# EAGLE design leoTracker (EAGLE 6.5.0)
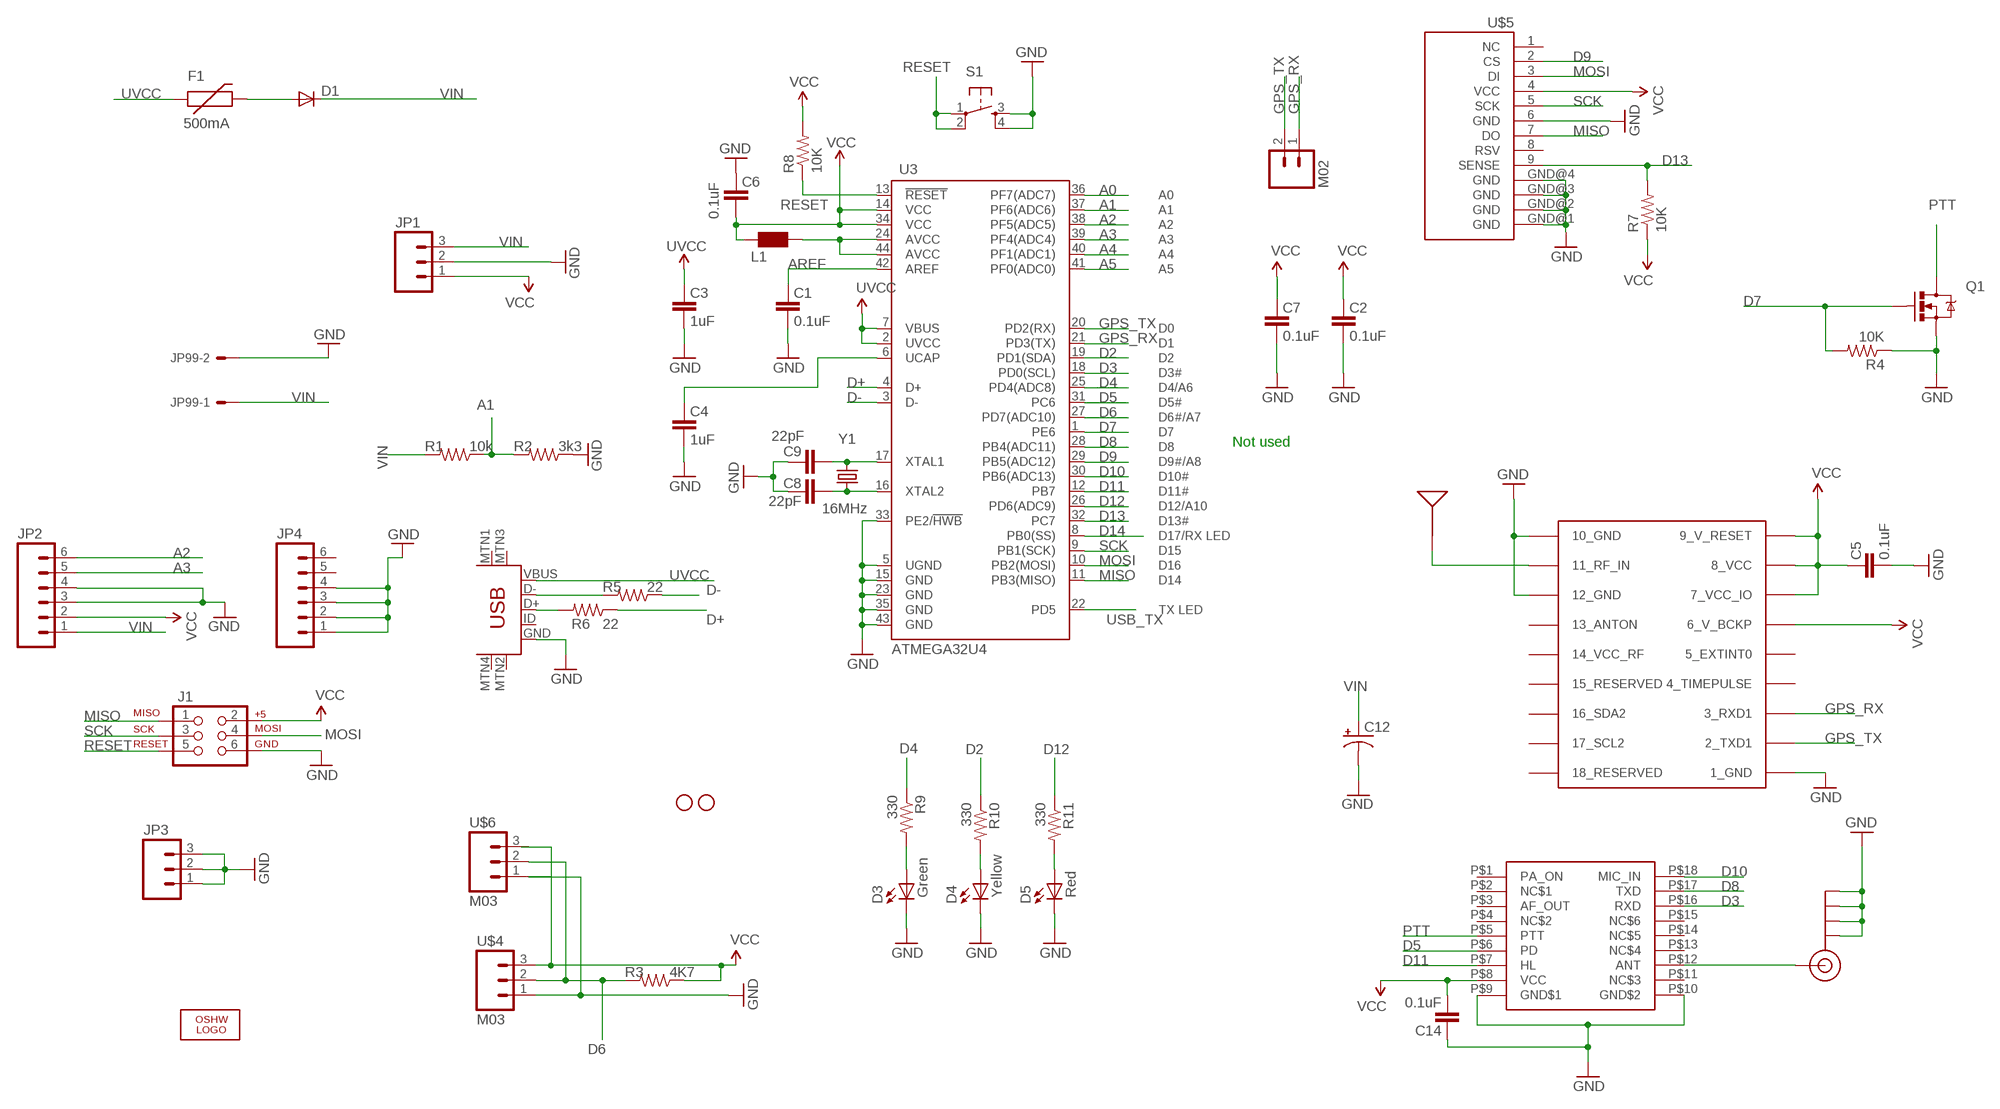
[diagram p0: schematic, sheet 1]

## Parts
C1  0.1uF  CAP0805  [0805]
C2  0.1uF  CAP0402-CAP  [0402-CAP]
C3  1uF  CAP0805  [0805]
C4  1uF  CAP0805  [0805]
C5  0.1uF  CAP0805  [0805]
C6  0.1uF  CAP0805  [0805]
C7  0.1uF  CAP0402-CAP  [0402-CAP]
C8  22pF  CAP0805  [0805]
C9  22pF  CAP0805  [0805]
C12  CPOL-US153CLV-0405  [153CLV-0405]
C14  0.1uF  CAP0805  [0805]
D1  DIODESOD  [SOD-323]
D3  Green  LED0603  [LED-0603]
D4  Yellow  LED0603  [LED-0603]
D5  Red  LED0603  [LED-0603]
F1  500mA  PTCSMD  [PTC-1206]
J1  AVR_SPI_PRG_6PTH  [2X3]
J$1  SMA_EDGE  [SMA-EDGE]
JP1  M03LOCK  [1X03_LOCK]
JP2  M06LOCK  [1X06_LOCK]
JP3  M03LOCK  [1X03_LOCK]
JP4  M06LOCK  [1X06_LOCK]
JP99  22-27-2021-02  [6410-02]
L1  MH2029-300Y  WE-CBF_0805  [0805]
LOGO1  OSHW_LOGO_8MILX0200-NT  [OSHW_8X200_NOTEXT]
Q1  MOSFET-NCHANNELSMD  [SOT23-3]
R1  10k  RESISTOR0805-RES  [0805]
R2  3k3  RESISTOR0805-RES  [0805]
R3  4K7  RESISTOR0805-RES  [0805]
R4  10K  RESISTOR0805-RES  [0805]
R5  22  RESISTOR0805-RES  [0805]
R6  22  RESISTOR0805-RES  [0805]
R7  10K  RESISTOR0805-RES  [0805]
R8  10K  RESISTOR0805-RES  [0805]
R9  330  RESISTOR0805-RES  [0805]
R10  330  RESISTOR0805-RES  [0805]
R11  330  RESISTOR0805-RES  [0805]
S1  TAC_SWITCHSMD  [TACTILE_SWITCH_SMD]
STANDOFF1  STAND-OFFTIGHT  [STAND-OFF-TIGHT]
STANDOFF2  STAND-OFFTIGHT  [STAND-OFF-TIGHT]
U3  ATMEGA32U4  ATMEGA32U4TQFP  [SPARKFUN-DIGITALIC_TQFP44]
U$1  ANTENNA2SMD6  [ANTENNA-CHIP6]
U$2  UBLOX_MAX  [UBLOX_MAX]
U$4  M03  [M03-JST]
U$5  MICROSD_PI  [MICROSD_PP]
U$6  M03  [M03-JST]
U$7  SA818  [SA818]
U$8  M02  [M02]
X1  USB-MINIB-5PIN  [USB-MINIB]
Y1  16MHz  ABRACON_ABM3_CRYSTAL  [ABRACON_ABM3_CRYSTAL]

## Nets
A0: U3.36(PF7(ADC7))
A1: R1.1 R2.2 U3.37(PF6(ADC6))
A2: JP2.6 U3.38(PF5(ADC5))
A3: JP2.5 U3.39(PF4(ADC4))
A4: U3.40(PF1(ADC1))
A5: U3.41(PF0(ADC0))
AREF: C1.2 U3.42(AREF)
D2: R10.1 U3.19(PD1(SDA))
D3: U3.18(PD0(SCL)) U$7.P$16(RXD)
D4: R9.1 U3.25(PD4(ADC8))
D5: U3.31(PC6) U$7.P$6(PD)
D6: R3.2 U3.27(PD7(ADC10)) U$4.2 U$6.2
D7: Q1.1(G) R4.2 U3.1(PE6)
D8: U3.28(PB4(ADC11)) U$7.P$17(TXD)
D9: U3.29(PB5(ADC12)) U$5.2(CS)
D10: U3.30(PB6(ADC13)) U$7.P$18(MIC_IN)
D11: U3.12(PB7) U$7.P$7(HL)
D12: R11.1 U3.26(PD6(ADC9))
D13: R7.2 U3.32(PC7) U$5.9(SENSE)
D14: U3.8(PB0(SS))
D+: R6.1 U3.4(D+)
D-: R5.1 U3.3(D-)
GND [vcc]: C1.1 C2.1 C3.1 C4.1 C5.1 C6.2 C7.1 C8.2 C9.2 C12.- C14.2 D3.C D4.C D5.C J1.6 J$1.GND@0(GND) J$1.GND@1(GND) J$1.GND@2(GND) J$1.GND@3(GND) JP1.2 JP2.3 JP2.4 JP3.1 JP3.2 JP3.3 JP4.1 JP4.2 JP4.3 JP4.4 JP99.2 Q1.2(S) R2.1 R4.1 S1.3 S1.4 U3.5(UGND) U3.15(GND) U3.23(GND) U3.33(PE2/!HWB) U3.35(GND) U3.43(GND) U$2.1_GND U$2.10_GND U$2.12_GND U$4.1 U$5.6(GND) U$5.GND@1(GND) U$5.GND@2(GND) U$5.GND@3(GND) U$5.GND@4(GND) U$6.1 U$7.P$9(GND$1) U$7.P$10(GND$2) X1.GND
GPS_RX: U3.21(PD3(TX)) U$2.3_RXD1 U$8.1
GPS_TX: U3.20(PD2(RX)) U$2.2_TXD1 U$8.2
MISO: J1.1 U3.11(PB3(MISO)) U$5.7(DO)
MOSI: J1.4 U3.10(PB2(MOSI)) U$5.3(DI)
N$1: C8.1 U3.16(XTAL2) Y1.P$1
N$2: C9.1 U3.17(XTAL1) Y1.P$2
N$3: D1.2(A) F1.2
N$4: C4.2 U3.6(UCAP)
N$5: D3.A R9.2
N$6: R5.2 X1.D-
N$7: D4.A R10.2
N$8: R6.2 X1.D+
N$10: D5.A R11.2
N$11: U$1.1(SIGNAL) U$2.11_RF_IN
N$15: L1.2 U3.24(AVCC) U3.44(AVCC)
N$20: J$1.SIG(SIGNAL) U$7.P$12(ANT)
PTT: Q1.3(D) U$7.P$5(PTT)
RESET: J1.5 R8.1 S1.1 S1.2 U3.13(!RESET)
SCK: J1.3 U3.9(PB1(SCK)) U$5.5(SCK)
USB_TX: U3.22(PD5)
UVCC: C3.2 F1.1 U3.2(UVCC) U3.7(VBUS) X1.VBUS
VCC: C2.2 C5.2 C6.1 C7.2 C14.1 J1.2 JP1.1 JP2.2 L1.1 R3.1 R7.1 R8.2 U3.14(VCC) U3.34(VCC) U$2.6_V_BCKP U$2.7_VCC_IO U$2.8_VCC U$2.9_V_RESET U$4.3 U$5.4(VCC) U$6.3 U$7.P$8(VCC)
VIN: C12.+ D1.1(C) JP1.3 JP2.1 JP99.1 R1.2
Unconnected: JP4.5 JP4.6 U$2.4_TIMEPULSE U$2.5_EXTINT0 U$2.13_ANTON U$2.14_VCC_RF U$2.15_RESERVED U$2.16_SDA2 U$2.17_SCL2 U$2.18_RESERVED U$5.1(NC) U$5.8(RSV) U$7.P$1(PA_ON) U$7.P$2(NC$1) U$7.P$3(AF_OUT) U$7.P$4(NC$2) U$7.P$11(NC$3) U$7.P$13(NC$4) U$7.P$14(NC$5) U$7.P$15(NC$6) X1.ID X1.MTN1(MTN2) X1.MTN2(MTN3) X1.MTN3(MTN1) X1.MTN4

## Notes on the sheet
- Not used

## Library data of the parts
C1 C3-C6 C8 C9 C14 = SparkFun-Capacitors:CAP: Capacitor Standard 0603 ceramic capacitor, and 0.1" leaded capacitor.
C2 C7 = SparkFun:CAP: Capacitor Standard 0603 ceramic capacitor, and 0.1" leaded capacitor.
C12 = rcl:CPOL-US: POLARIZED CAPACITOR, American symbol
D1 = SparkFun:DIODE: Diode These are standard reverse protection diodes and small signal diodes. SMA package can handle up to about 1A. SOD-323 can handle about 200mA. What the SOD-323 package when ordering, there are some mfgs out there that are 5-pin packages.
D3-D5 = SparkFun-LED:LED: LEDs Standard schematic elements and footprints for 5mm, 3mm, 1206, and 0603 sized LEDs. 5mm - Spark Fun Electronics SKU : COM-00529 (and others)
F1 = SparkFun:PTC: Resettable Fuse PTC Resettable Fuse. Spark Fun Electronics SKU : COM-08357
J1 = SparkFun-Connectors:AVR_SPI_PRG_6: AVR ISP 6 Pin This is the reduced ISP connector for AVR programming. Common on Arduino. This footprint will take up less PCB space and can be used with a 10-pin to 6-pin adapter such as SKU: BOB-08508
J$1 = SparkFun:SMA_EDGE: SMA Antenna Connector End launch SMA connector. The paste layer has been removed so that the connector can be hand soldered onto the board after reflow.
JP1 JP3 = SparkFun:M03: Header 3 Standard 3-pin 0.1" header. Use with straight break away headers (SKU : PRT-00116), right angle break away headers (PRT-00553), swiss pins (PRT-00743), machine pins (PRT-00117), and female headers (PRT-00115). Molex polarized connector foot print use with SKU : PRT-08232 with associated crimp pins and housings.
JP2 JP4 = SparkFun:M06: Header 6 Standard 6-pin 0.1" header. Use with straight break away headers (SKU : PRT-00116), right angle break away headers (PRT-00553), swiss pins (PRT-00743), machine pins (PRT-00117), and female headers (PRT-00115). Molex polarized connector foot print use with SKU : PRT-08094 with associated crimp pins and housings. NOTES ON THE VARIANTS LOCK and LOCK_LONGPADS... This footprint was designed to help hold the alignment of a through-hole component (i.e. 6-pin header) while soldering it into place. You may notice that each hole has been shifted either up or down by 0.005 of an inch from it's more standard position (which is a perfectly straight line). This slight alteration caused the pins (the squares in the middle) to touch the edges of the holes. Because they are alternating, it causes a "brace" to hold the component in place. 0.005 has proven to be the perfect amount of "off-center" position when using our standard breakaway headers. Although looks a little odd when you look at the bare footprint, once you have a header in there, the alteration is very hard to notice. Also, if you push a header all the way into place, it is covered up entirely on the bottom side. This idea of altering the position of holes to aid alignment will be further integrated into the Sparkfun Library for other footprints. It can help hold any component with 3 or more connection pins.
JP99 = con-molex:22-?-02: CONNECTOR wire to board 2.54 mm (.1 inch) pitch header; OC_FARNELL: unknown; OC_NEWARK: unknown
L1 = wuerth-elektronik:WE-CBF: SMD EMI Suppression Ferrite Beads - excellent anti-EMI properties - low DCR - impedances till 3000 ohms - rated current up to 6 A
LOGO1 = ohw-logo:OSHW_LOGO_8MIL
Q1 = SparkFun:MOSFET-NCHANNEL
R1-R11 = SparkFun-Passives:RESISTOR: Resistor Basic schematic elements and footprints for 0603, 1206, and PTH resistors.
S1 = SparkFun:TAC_SWITCH: Momentary Switch Button commonly used for reset or general input. Spark Fun Electronics SKU : COM-00097
STANDOFF1 STANDOFF2 = SparkFun-Electromechanical:STAND-OFF: #4 Stand Off This is the mechanical footprint for a #4 phillips button head screw. Use the keepout ring to avoid running the screw head into surrounding components. SKU : PRT-00447
U3 = SparkFun-DigitalIC:ATMEGA32U4: Atmel 44-pin 8-bit Microcontroller with 32KBytes of ISP Flash and USB Controller ----- Please use the QFN-44-NOPAD_1:1 package for the footprint of all boards using a 32U4. Route traces directly away from the pads as much as possible.; PROD_ID: IC-11161
U$1 = SparkFun-RF:ANTENNA2: Chip antenna Single endded antenna. Common with smaller chip antennas. CHIP4 package is the GPS Chip Antenna SKU: GPS-08418. CHIP5 package is 2.4GHz chip antenna SKU: WRL-00144.
U$2 = Ava:UBLOX_MAX: UBLOX MAX
U$4 U$6 = Ava2:M03
U$5 = MICROSD_PITO:MICROSD_PI
U$7 = nicerf:SA818
U$8 = hackedAva:M02
X1 = SparkFun-Connectors:USB-MINIB: Mini-USB "B" connector with 5th pin broken out. Created new symbol breaking out 5th "ID" pin in mini/micro USB connector spec. See: http://en.wikipedia.org/wiki/Mini_usb#Cables. Uses same footprint as 4-pin symbol. Also added pins to connect to mounting / shield pads if required (probably not generally needed as signals aren't shielded once they leave the connector).
Y1 = newAva:ABRACON_ABM3_CRYSTAL

## Net classes
0 ten10: width 0.254 mm
1 vcc: width 0.254 mm
2 20: width 0.508 mm

## Board
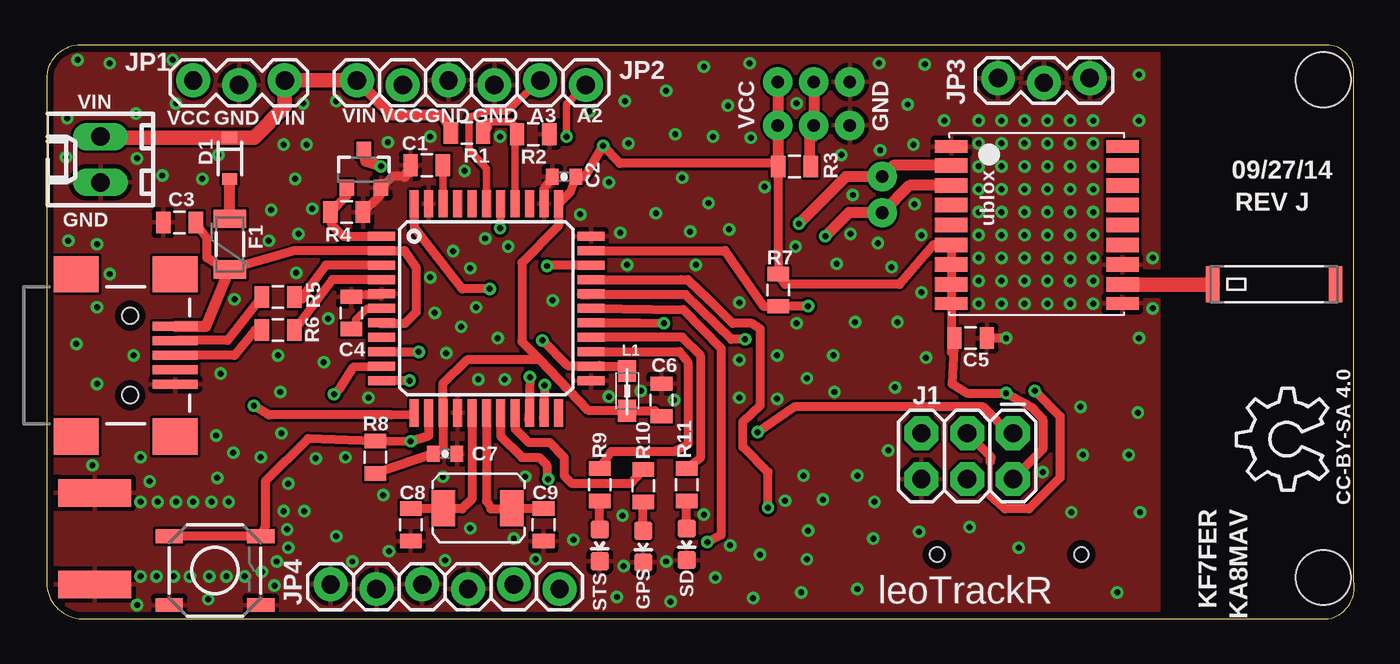
[diagram p1: board, top side]
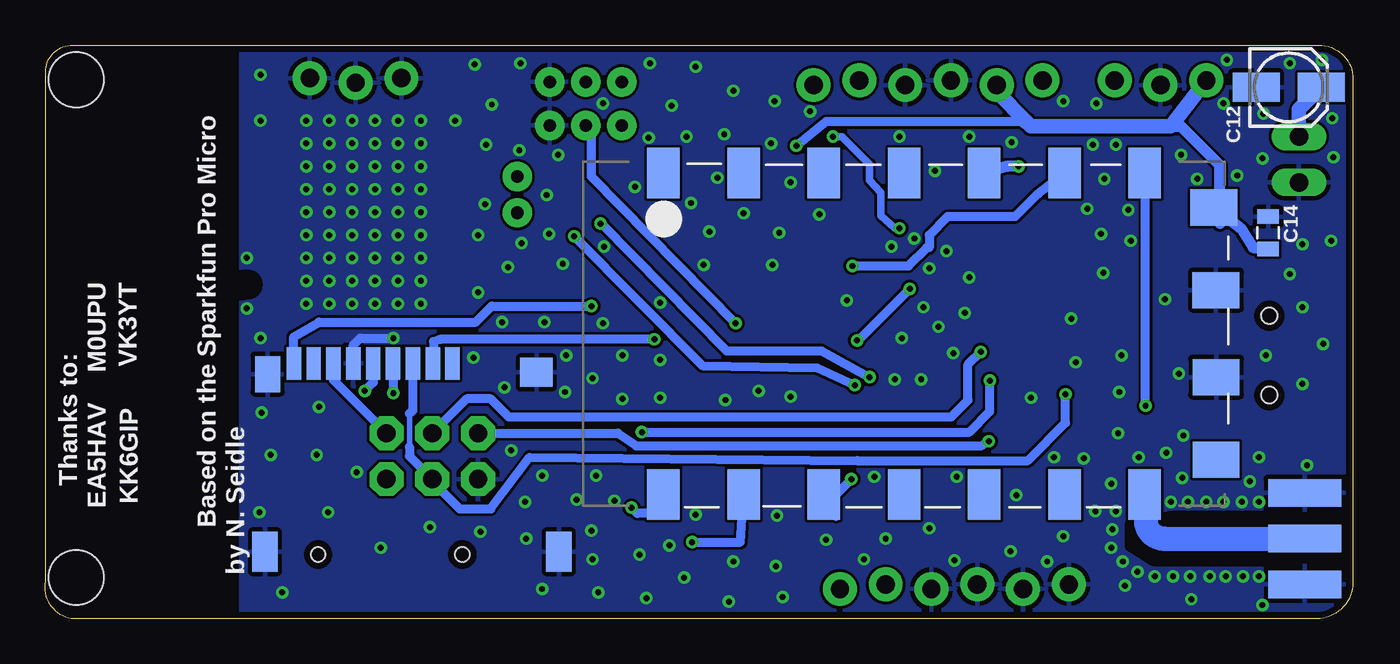
[diagram p2: board, bottom side, seen from below]

Size 72.53 x 31.81 mm. Coordinates in mm from the lower left corner, seen from the top.
Outline: 2,0 71.07,0 arc90 72.5,2.06 72.5,30.18 arc90 71.14,31.8 2.06,31.8 arc90 0,30.11 0,2 arc90 2,0
Copper layers (1*16): Top 0.0356mm / dielectric 1.5011mm / Bottom 0.0356mm
Design rules "LaenPCBOrder *": minimum track width 6mil, minimum drill 13mil, track to track 6mil, track to pad 6mil, pad to pad 6mil, via to via 6mil, smd to smd 6mil, copper to edge 15mil, drill to drill 6mil, minimum pad ring 7mil, minimum via ring 7mil, stop-mask expansion 3mil, vias tented up to drill 25mil, thermal gap 10mil
tRestrict: 2 lines
bRestrict: 7 lines

### Footprints (pad centres in the part's own frame; a part is rotated, then mirrored left to right if it is on the bottom)
0805 = smd 0.8 x 1.2: 1 -0.9,0; 2 0.9,0
0402-CAP = smd 0.7 x 0.9: 1 -0.65,0; 2 0.65,0
153CLV-0405 = smd 2.6 x 1.6: + 1.8,0; - -1.8,0
SOD-323 = smd 0.63 x 0.83: 1 -1.15,0; 2 1.15,0
LED-0603 = smd 1 x 1: A 0,-0.877; C 0,0.877
PTC-1206 = smd 1 x 1.8: 1 -1.4,0; 2 1.4,0
2X3 = drill 1.016 pad 1.88 octagon: 1 0,0; 2 0,2.54; 3 2.54,0; 4 2.54,2.54; 5 5.08,0; 6 5.08,2.54
SMA-EDGE = smd 1.524 x 4.064: GND@0 0,0; GND@1 5.08,0; SIG 2.54,0 | smd 1.524 x 4.064 bottom: GND@2 0,0; GND@3 5.08,0
1X03_LOCK = drill 1.016 pad 1.88: 1 0,0.127; 2 2.54,-0.127; 3 5.08,0.127
1X06_LOCK = drill 1.016 pad 1.88: 1 0,0; 2 2.54,-0.254; 3 5.08,0; 4 7.62,-0.254; 5 10.16,0; 6 12.7,-0.254
6410-02 = drill 1.016 long: 1 1.27,0; 2 -1.27,0
0805' = smd 1.2 x 1: 1 -1.1,0; 2 1.1,0
SOT23-3 = smd 0.8 x 0.9: 1 -0.95,-1; 2 0.95,-1; 3 0,1.1
TACTILE_SWITCH_SMD = smd 1.524 x 0.762: 1 -2.54,1.905; 2 2.54,1.905; 3 -2.54,-1.905; 4 2.54,-1.905
STAND-OFF-TIGHT = hole 3.048: 0,0
SPARKFUN-DIGITALIC_TQFP44 = smd 1.5 x 0.5: 1 -5.8,4; 2 -5.8,3.2; 3 -5.8,2.4; 4 -5.8,1.6; 5 -5.8,0.8; 6 -5.8,0; 7 -5.8,-0.8; 8 -5.8,-1.6; 9 -5.8,-2.4; 10 -5.8,-3.2; 11 -5.8,-4; 23 5.8,-4; 24 5.8,-3.2; 25 5.8,-2.4; 26 5.8,-1.6; 27 5.8,-0.8; 28 5.8,0; 29 5.8,0.8; 30 5.8,1.6; 31 5.8,2.4; 32 5.8,3.2; 33 5.8,4 | smd 0.5 x 1.5: 12 -4,-5.8; 13 -3.2,-5.8; 14 -2.4,-5.8; 15 -1.6,-5.8; 16 -0.8,-5.8; 17 0,-5.8; 18 0.8,-5.8; 19 1.6,-5.8; 20 2.4,-5.8; 21 3.2,-5.8; 22 4,-5.8; 34 4,5.8; 35 3.2,5.8; 36 2.4,5.8; 37 1.6,5.8; 38 0.8,5.8; 39 0,5.8; 40 -0.8,5.8; 41 -1.6,5.8; 42 -2.4,5.8; 43 -3.2,5.8; 44 -4,5.8
ANTENNA-CHIP6 = smd 0.75 x 2: 1 -3.4,0; NC 3.4,0
UBLOX_MAX = smd 1.8 x 0.7: 1_GND 4.95,-4.4; 9_V_RESET 4.95,4.3; 10_GND -4.55,4.3; 18_RESERVED -4.55,-4.4 | smd 1.8 x 0.8: 2_TXD1 4.95,-3.35; 3_RXD1 4.95,-2.25; 4_TIMEPULSE 4.95,-1.15; 5_EXTINT0 4.95,-0.05; 6_V_BCKP 4.95,1.05; 7_VCC_IO 4.95,2.15; 8_VCC 4.95,3.25; 11_RF_IN -4.55,3.25; 12_GND -4.55,2.15; 13_ANTON -4.55,1.05; 14_VCC_RF -4.55,-0.05; 15_RESERVED -4.55,-1.15; 16_SDA2 -4.55,-2.25; 17_SCL2 -4.55,-3.35
M03-JST = drill 0.7 pad 1.626: 1 -2,0.08; 2 0,0.08; 3 2,0.08
MICROSD_PP = smd 1.8 x 0.8: 1 0,3.85; 2 0,2.75; 3 0,1.65; 4 0,0.55; 5 0,-0.55; 6 0,-1.65; 7 0,-2.75; 8 0,-3.85; 9 0,-4.95 | smd 1.6 x 1.8: GND@1 0.5,8.5 | smd 2.2 x 1.4: GND@2 10.45,9.75; GND@4 10.45,-6.55 | smd 2 x 1.4: GND@3 0.6,-6.4 | hole 0.8: 10.6,4.4; 10.6,-3.6
SA818 = smd 1.8 x 2.8: P$1 13.35,-9.525; P$2 8.9,-9.525; P$3 4.45,-9.525; P$4 0,-9.525; P$5 -4.45,-9.525; P$6 -8.9,-9.525; P$7 -13.35,-9.525; P$12 -13.35,8.275; P$13 -8.9,8.275; P$14 -4.45,8.275; P$15 0,8.275; P$16 4.45,8.275; P$17 8.9,8.275; P$18 13.35,8.275 | smd 2.6 x 2: P$8 -17.175,-7.625; P$9 -17.3,-3.043; P$10 -17.31,1.778; P$11 -17.31,6.355
M02 = drill 0.7 pad 1.626: 1 0.032,0.08; 2 2.032,0.08
USB-MINIB = smd 2.5 x 0.5: D+ 2.5,0; D- 2.5,0.8; GND 2.5,-1.6; ID 2.5,-0.8; VBUS 2.5,1.6 | smd 2.5 x 2: MTN1 -3,4.5; MTN2 2.5,4.5; MTN3 -3,-4.5; MTN4 2.5,-4.5 | hole 0.9: 0,2.2; 0,-2.2
ABRACON_ABM3_CRYSTAL = smd 1.3 x 2: P$1 -3.4,0.1; P$2 0.4,0.1

### Placement (x,y rotation side)
C1  21.08,25.15 0 top
C2  28.7,24.51 0 top
C3  7.37,21.97 0 top
C4  16.89,16.95 270 top
C5  51.24,15.56 180 top
C6  34.1,12.13 90 top
C7  22.1,9.14 180 top
C8  20.19,5.21 270 top
C9  27.56,5.21 270 top
C12  3.56,29.46 0 bottom
C14  4.7,21.4 90 bottom
D1  10.16,25.53 270 top
D3  30.67,4.06 180 top
D4  33.08,4 180 top
D5  35.5,4.13 180 top
F1  10.16,20.76 90 top
J1  53.59,10.29 180 top
J$1  2.67,1.91 90 bottom
JP1  8.13,29.72 0 top
JP2  17.21,29.84 0 top
JP3  52.77,29.84 0 top
JP4  15.75,1.91 0 top
JP99  2.98,25.46 90 top
L1  MH2029-300Y  [0805']  32.19,12.64 90 top
LOGO1  71.06,7.11 90 top
Q1  17.59,24.89 0 top
R1  23.3,26.92 180 top
R2  26.99,26.86 180 top
R3  41.47,25.08 0 top
R4  16.64,22.54 180 top
R5  12.83,17.84 180 top
R6  12.83,16 180 top
R7  40.58,18.22 270 top
R8  18.22,8.95 270 top
R9  30.67,7.43 270 top
R10  33.08,7.37 270 top
R11  35.5,7.43 270 top
S1  9.33,2.67 0 top
STANDOFF1  70.8,29.89 0 top
STANDOFF2  70.8,2.29 0 top
U3  24.38,17.21 0 top
U$1  68.07,18.54 0 top
U$2  55.12,21.78 180 top
U$4  42.54,29.84 180 top
U$5  53.78,14.16 270 bottom
U$6  42.54,27.43 180 top
U$7  24.89,15.18 180 bottom
U$8  46.42,22.48 90 top
X1  4.64,14.61 0 top
Y1  25.4,6.03 0 top

### Tracks (layer width: path | path; a pad name or v marks a point on that pad's centre or on a via)
A1
  Top 0.406: U3.37 25.98,26.39 R2.2 26.09,27.19 25.72,27.56 24.51,27.56 | 24.45,27.5 24.51,27.56 | 24.51,27.56 24.51,27.23 R1.1
A2  (via drill 0.33)
  Top 0.406: 25.15,23.05 U3.38 25.18,21.69 v25.15,21.65 | v28.83,26.73 28.83,28.51 JP2.6
  Bottom 0.406: v25.15,21.65 25.4,21.65 26.16,22.35 26.16,23.62 26.8,24.32 26.8,25.21 28.32,26.73 v28.83,26.73
A3
  Top 0.406: U3.39 24.38,24.96 23.43,26.04 23.43,27.81 24.38,28.13 25.53,28.13 JP2.5
AREF
  Top 0.406: U3.42 21.98,23.87 C1.2
D2
  Top 0.508: R10.1 32.96,8.13 32.39,7.49 29.15,7.49 28.7,7.94 28.7,8.95 27.88,9.78 26.73,9.78 25.98,10.53 U3.19 25.97,11.4
D3  (via drill 0.33)
  Top 0.508: U3.18 25.18,10.12 26.35,8.95 27.3,8.95 27.75,8.51 27.75,7.81 v27.81,7.75
  Bottom 0.406: U$7.P$16 28.66,5.63
  Bottom 0.508: v27.81,7.75 28.7,6.86 29.3,6.86 U$7.P$16
D4
  Top 0.508: U3.25 35.1,14.81 35.56,14.22 35.56,9.65 34.8,9.27 31.31,9.27 R9.1
D5  (via drill 0.33)
  Top 0.508: U3.31 27.83,19.61 v27.75,19.56
  Bottom 0.508: v27.75,19.56 24.64,19.56 23.62,20.57 23.49,20.57 23.49,21.27 22.48,22.29 18.73,22.29 17.46,23.56 U$7.P$6
D6  (via drill 0.33)
  Top 0.508: U3.27 32.85,16.41 v34.23,16.38 | 42.29,27.37 42.53,27.37 U$6.2
  Top 0.61: U$4.2 U$6.2 42.54,26.73 42.29,27.37 42.29,25.52 R3.2
  Bottom 0.508: v34.23,16.38 42.23,24.51 42.23,27.04 | 42.23,27.04 U$6.2 | 42.23,27.04 42.27,27.04 42.54,27.3
D7
  Top 0.508: U3.1 17.95,21.21 16.45,21.21 15.81,21.84 15.81,22.47 R4.2 16.64,23.45 Q1.1
D8  (via drill 0.33)
  Top 0.508: U3.28 35.31,17.14 37.4,14.99 37.4,4.64 v36.64,4.25
  Bottom 0.508: v36.64,4.25 33.96,4.25 U$7.P$17
D9  (via drill 0.33)
  Top 0.508: v38.74,15.49 37.97,15.49 35.43,17.97 30.15,17.97 | 29.65,17.97 30.15,17.97 | 30.15,17.97 U3.29
  Bottom 0.508: v38.74,15.49 50.61,15.49 50.99,15.37 50.99,14.2 U$5.2
D10  (via drill 0.33)
  Top 0.508: U3.30 35.17,18.81 35.56,18.8 36.77,17.65 38.04,16.38 39.12,16.38 39.56,16.07 39.56,11.81 38.61,10.92 38.61,9.53 40,8.13 v40,6.16
  Bottom 0.508: U$7.P$18 38.03,5.84 39.69,5.84 v40,6.16
D11  (via drill 0.33)
  Top 0.508: U3.12 20.28,11.28 19.11,11.3 12.32,11.3 v11.49,11.81
  Bottom 0.508: v11.49,11.81 11.49,23.54 U$7.P$7
D12
  Top 0.508: U3.26 30.01,15.62 35.24,15.62 36.26,14.61 36.26,8.9 R11.1
D13  (via drill 0.33)
  Top 0.508: v42.23,17.34 R7.2 40.31,17.27 39.75,17.34 37.63,20.41 U3.32
  Bottom 0.508: U$5.9 58.73,15.62 57.34,16.45 48.64,16.45 47.75,17.34 v42.23,17.34
D+
  Top 0.508: U3.4 15.83,18.81 R6.1
D-
  Top 0.406: 14.17,17.72 R5.1
  Top 0.508: U3.3 15.48,19.61 14.16,17.84 14.17,17.72
GND  (via drill 0.33)
  Top 0.508: U3.35 27.58,23.84 C2.1 | U3.43 21.18,22.87 | v53.21,15.56 C5.1 | C4.1 17.28,17.98 17.72,17.97 18.55,17.97 U3.5 | R4.1 18.54,23.55 Q1.2 19.17,24.53 19.83,24.53
  Top 0.61: 19.83,24.53 20.32,25.02 C1.1
  Bottom 0.508: U$5.6 55.43,15.18 55.05,15.56 v53.21,15.56
  other vias: 31.18,12.32 43.81,19.68 48.13,22.99 10.41,17.72 17.84,12.26 22.16,14.73 28.07,17.65 30.1,28.13 6.16,6.48 5.21,2.35 6.1,2.35 7.94,2.35 9.02,2.35 9.97,2.35 13.33,4.95 41.85,1.46 5.21,6.48 42.23,4.89 7.18,6.48 13.4,7.49 7.05,2.35 10.99,2.35 56.77,23.81 55.5,23.81 54.23,23.81 54.23,22.54 55.5,22.54 56.77,22.54 56.77,21.27 55.5,21.27 54.23,21.27 54.23,20 55.5,20 56.77,20 56.77,18.73 55.5,18.73 54.23,18.73 52.96,18.73 52.96,20 52.96,21.27 52.96,22.54 52.96,23.81 52.96,25.08 54.23,25.08 55.5,25.08 56.77,25.08 58.04,18.73 58.04,20 58.04,21.27 58.04,22.54 58.04,23.81 58.04,25.08 58.04,26.35 56.77,26.35 55.5,26.35 54.23,26.35 52.96,26.35 52.96,27.62 54.23,27.62 55.5,27.62 56.77,27.62 58.04,27.62 12.45,22.67 1.71,30.99 60.58,15.56 49.78,27.62 46.23,25.97 48.51,21.27 48.51,18.1 44.7,23.5 48.7,30.73 37.78,28.45 39.05,26.67 35.24,24.45 37.85,21.59 35.69,21.46 31.81,21.4 38.42,14.35 43.62,14.61 38.42,12.26 48.77,14.48 57.34,11.75 60.52,11.43 56.83,5.91 53.91,3.94 51.18,5.08 48.39,4.83 45.91,6.48 37.91,4.06 36.45,5.78 42.16,3.3 43.05,6.6 32.26,26.35 46.16,30.8 1.21,20.95 13.14,26.29 13.97,21.34 12.32,20.95 32.19,19.62 22.54,20.38 21.27,18.92 25.4,13.27 23.94,13.27 15.37,14.22 13.84,19.18 15.62,16.64 12.83,14.61 12.95,12.57 13.02,10.29 14.92,8.89 16.95,3.17 23.5,5.02 27.11,3.3 13.4,3.94 10.35,9.21 5.21,8.95 2.54,8.51 8.95,1.08 9.65,13.59 2.79,13.02 2.79,17.27 48.07,26.29 8.64,24.38 46.1,20.83 39.81,23.94 46.86,19.49 18.67,6.86 16.07,4.57 34.8,12.13 29.59,22.42 9.4,10.16 59.37,1.46 44.96,1.65 36.96,26.73 36,19.62 9.52,25.72 58.04,17.46 56.77,17.46 55.5,17.46 54.23,17.46 52.96,17.46 51.69,27.62 51.69,26.35 51.69,25.08 51.69,23.81 51.69,22.54 51.69,21.27 51.69,20 51.69,18.73 51.69,17.46 44.83,16.45 44.07,25.72 41.97,7.94 44.96,7.94 40.96,6.54 57.47,9.08 25.02,15.56 41.59,28.57 55.24,8.13 44.58,21.34 39.56,3.56 60.64,5.91 32.07,28.7 47.75,28.51 1.65,15.24 40.51,14.61 61.34,17.21 61.34,20 46.67,9.33 43.69,12.57 47.05,12.83 47.18,16.45 34.86,26.86 34.35,29.27 14.29,5.97 16.57,8.95 11.87,8.95 32,2.92 31.62,1.21 34.35,3.17 37.08,2.29 29.21,4.38 21.97,7.87 36.45,30.61 38.99,30.8 14.41,26.29 25.59,20.64 24.32,21.08 23.81,17.27 21.53,16.95 4.83,14.61 9.46,7.81 38.42,17.53 41.53,20.64 32.96,12.64 25.91,4.45 22.1,3.24 26.54,7.87 18.99,3.75 39.18,1.14 23.5,19.43 14.22,28.57 18.92,26.42 14.73,22.73 6.41,24.57 2.79,20.76 3.49,19.11 7.18,28.57 4.95,28 1.14,27.75 1.08,25.59 5.02,25.53 41.59,16.38 40.51,12.19 42.16,13.34 8.13,6.48 9.14,6.48 10.1,6.48 5.72,7.62 12.76,3.17 12.64,1.84 5.02,0.76 21.27,26.73 23.18,24.83 25.15,26.73 33.78,22.48 31.18,24.19 36.7,23.05 22.99,16.19 13.78,24.38 3.49,30.8 16.07,28.7 45.85,4.45 60.58,27.62 60.58,30.16 60.01,9.08 11.94,2.6 13.14,5.97 6.99,30.99 31.94,5.71 34.61,0.95
  pour Bottom: 0.06,31.75 61.66,31.75 61.66,0 0.06,0
  pour Top: 0.06,31.75 61.66,31.75 61.66,0 0.06,0
GPS_RX  (via drill 0.33)
  Top 0.508: 43.75,21.78 44.26,22.35 v43.18,21.21 | v27.62,12.95 27.56,11 U3.21
  Top 0.61: U$2.3_RXD1 47.86,24.03 U$8.1 44.48,22.51 v43.18,21.21
  Bottom 0.508: v43.18,21.21 36.07,14.03 29.72,13.91 v27.62,12.95
GPS_TX  (via drill 0.33)
  Top 0.508: 42.04,22.23 v41.72,21.91 | v26.8,13.4 26.73,10.98 U3.20
  Top 0.61: U$2.2_TXD1 46.96,25.13 U$8.2 44.32,24.51 v41.72,21.91
  Bottom 0.508: v41.72,21.91 41.66,21.91 34.73,14.86 29.46,14.86 v26.8,13.4
MISO  (via drill 0.33)
  Top 0.508: J1.1 53.4,10.29 51.94,11.75 41.47,11.75 v39.43,10.35 | v20.13,13.21 U3.11
  Bottom 0.508: U$5.7 56.53,13.23 J1.1 | v39.43,10.35 21.27,10.35 20.13,11.49 v20.13,13.21
MOSI  (via drill 0.33)
  Top 0.508: v15.94,12.45 16.26,12.76 17.03,13.97 U3.10
  Bottom 0.305: 52.32,11.37 52.32,9.53
  Bottom 0.508: U$5.3 52.13,11.56 52.32,11.37 | 52.32,9.53 52.32,9.02 J1.4 51.05,7.62 49.53,6.1 47.82,6.1 45.66,8.95 27.5,8.76 18.03,8.76 15.94,10.86 v15.94,12.45
N$1
  Top 0.508: U3.16 23.58,6.63 23.05,6.1 22.16,6.1 | 22.16,6.1 Y1.P$1 | 22.16,6.1 20.2,6.1 C8.1
N$2
  Top 0.508: U3.17 24.38,6.54 24.64,6.1 25.89,6.1 Y1.P$2 27.85,6.13 C9.1
N$3
  Top 0.61: F1.2 D1.2
N$4
  Top 0.406: U3.6 17.78,17.21 17.14,16.57 17.14,16.31 C4.2
N$5
  Top 0.508: D3.A R9.2
N$6
  Top 0.406: 7.22,15.43 X1.D-
  Top 0.508: R5.2 11.87,17.78 10.03,15.43 7.22,15.43
N$7
  Top 0.508: D4.A R10.2
N$8
  Top 0.508: R6.2 11.56,16 10.41,14.61 X1.D+
N$10
  Top 0.508: D5.A R11.2
N$11
  Top 0.813: U$2.11_RF_IN 64.47,18.53 U$1.1
N$15  (via drill 0.33)
  Top 0.508: L1.2 31.83,14.01 U3.24 30.65,14.03 28.89,14.03 v27.5,15.43 | U3.44 20.38,21.72 | 20.38,21.72 20.38,21.59 | v24.57,18.29 23.05,18.29 20.38,21.72
  Bottom 0.508: v27.5,15.43 27.43,15.43 v24.57,18.29
N$20
  Bottom 1.321: 1.88,4.49 4.51,4.49 4.47,4.45 | 1.33,4.45 4.47,4.45 | U$7.P$12 11.48,5.45 arc-90 10.48,4.45 4.47,4.45
  Bottom 1.422: 1.33,4.45 J$1.SIG
PTT  (via drill 0.33)
  Top 0.61: Q1.3 17.7,25.36 v18.54,25.08
  Bottom 0.61: v18.54,25.08 19.17,25.08 U$7.P$5
RESET  (via drill 0.33)
  Top 0.508: U3.13 21.18,10.16 | 21.18,10.16 20.17,9.82 18.1,9.84 17.98,9.78 R8.1 14.49,9.98 12.13,7.62 12.13,5.14 S1.2 S1.1 | v20.19,9.84 20.23,9.84 21.18,10.16
  Bottom 0.508: J1.5 40.77,10.29 39.75,9.59 20.64,9.59 v20.19,9.84
SCK  (via drill 0.33)
  Top 0.305: 52.32,6.86 52.32,8.7
  Top 0.508: U3.9 v20.62,14.81 v20.64,14.8 | v54.8,12.64 56.2,11.24 56.2,7.81 54.48,6.1 53.15,6.1 52.32,6.86 | 52.32,8.7 52.39,8.95 J1.3
  Bottom 0.508: J1.3 49.15,12.19 47.82,12.19 46.8,11.18 22.29,11.18 21.34,12.13 21.34,14.1 v20.64,14.8 | U$5.5 54.33,13.1 v54.8,12.64
UVCC
  Top 0.508: C3.2 8.89,21.09 8.89,20 9.78,19.43 F1.1 13.74,20.41 U3.2 19.85,20.41 20.51,19.43 20.51,17.02 19.88,16.38 18.49,16.38 U3.7
  Top 0.61: X1.VBUS 8.84,16.2 F1.1
VCC  (via drill 0.33)
  Top 0.508: 18.36,8.19 R8.2 18.24,8.06 C7.2 21.98,9.43 U3.14 21.97,11.42 21.97,13.02 23.3,14.35 27.37,14.35 | R3.1 40.57,20.51 R7.1 40.95,18.54 47.31,18.54 49.18,20.73 U$2.6_V_BCKP U$2.7_VCC_IO U$2.8_VCC U$2.9_V_RESET 50.17,14.78 C5.2 50.22,13.03 51.05,12.51 v53.21,12.51 54.61,11.75 55.24,11.05 55.24,9.4 J1.2 | 40.54,25.25 31.79,25.25 v30.86,26.23 29.85,24.51 C2.2 29.03,23.66 U3.34 28.38,21.78 26.35,19.75 26.35,15.37 27.37,14.35 | 27.37,14.35 30.06,11.54 L1.1 33.73,11.54 C6.1
  Top 0.61: U$4.3 U$6.3 40.54,25.25 R3.1
  Bottom 0.406: 40.27,30.04 U$4.3
  Bottom 0.508: U$5.4 53.23,12.72 v53.21,12.51 | 18.16,27.56 29.21,27.56 v30.86,26.23
  Bottom 0.61: 10.1,27.3 9.54,27.3 7.37,25.13 7.37,21.91 7.46,22.58 U$7.P$8 6.19,21.62 5.52,20.57 5.22,20.57 C14.1
  Bottom 0.813: JP2.2 19.75,29.21 18.1,27.56 | 18.16,27.56 18.1,27.56 | 18.1,27.56 17.84,27.3 10.1,27.3 8.87,28.89 JP1.1 8.26,29.71
VIN
  Top 0.61: JP2.1 19.11,27.94 21.91,27.94 22.35,27.3 22.35,26.93 R1.2
  Top 0.813: JP2.1 JP1.3 13.21,28.38 11.49,26.67 D1.1 | D1.1 3.05,26.67 JP99.1 | D1.1
  Bottom 0.813: JP99.1 2.98,28.23 C12.+

### Text on the board
tPlace: VCC | GND | VIN | VCC | GND | VIN | VIN | VCC | GND | GND | A3 | A2 | 09/27/14 | REV J | GND | CC-BY-SA 4.0 | KF7FER | KA8MAV | GPS | SD | leoTrackR | STS
bPlace: Based on the Sparkfun Pro Micro | VK3YT | M0UPU | Thanks to: | KK6GIP | EA5HAV | by N. Seidle